# EAGLE design DC24-Darknet_Badge-shield (EAGLE 7.5.0)
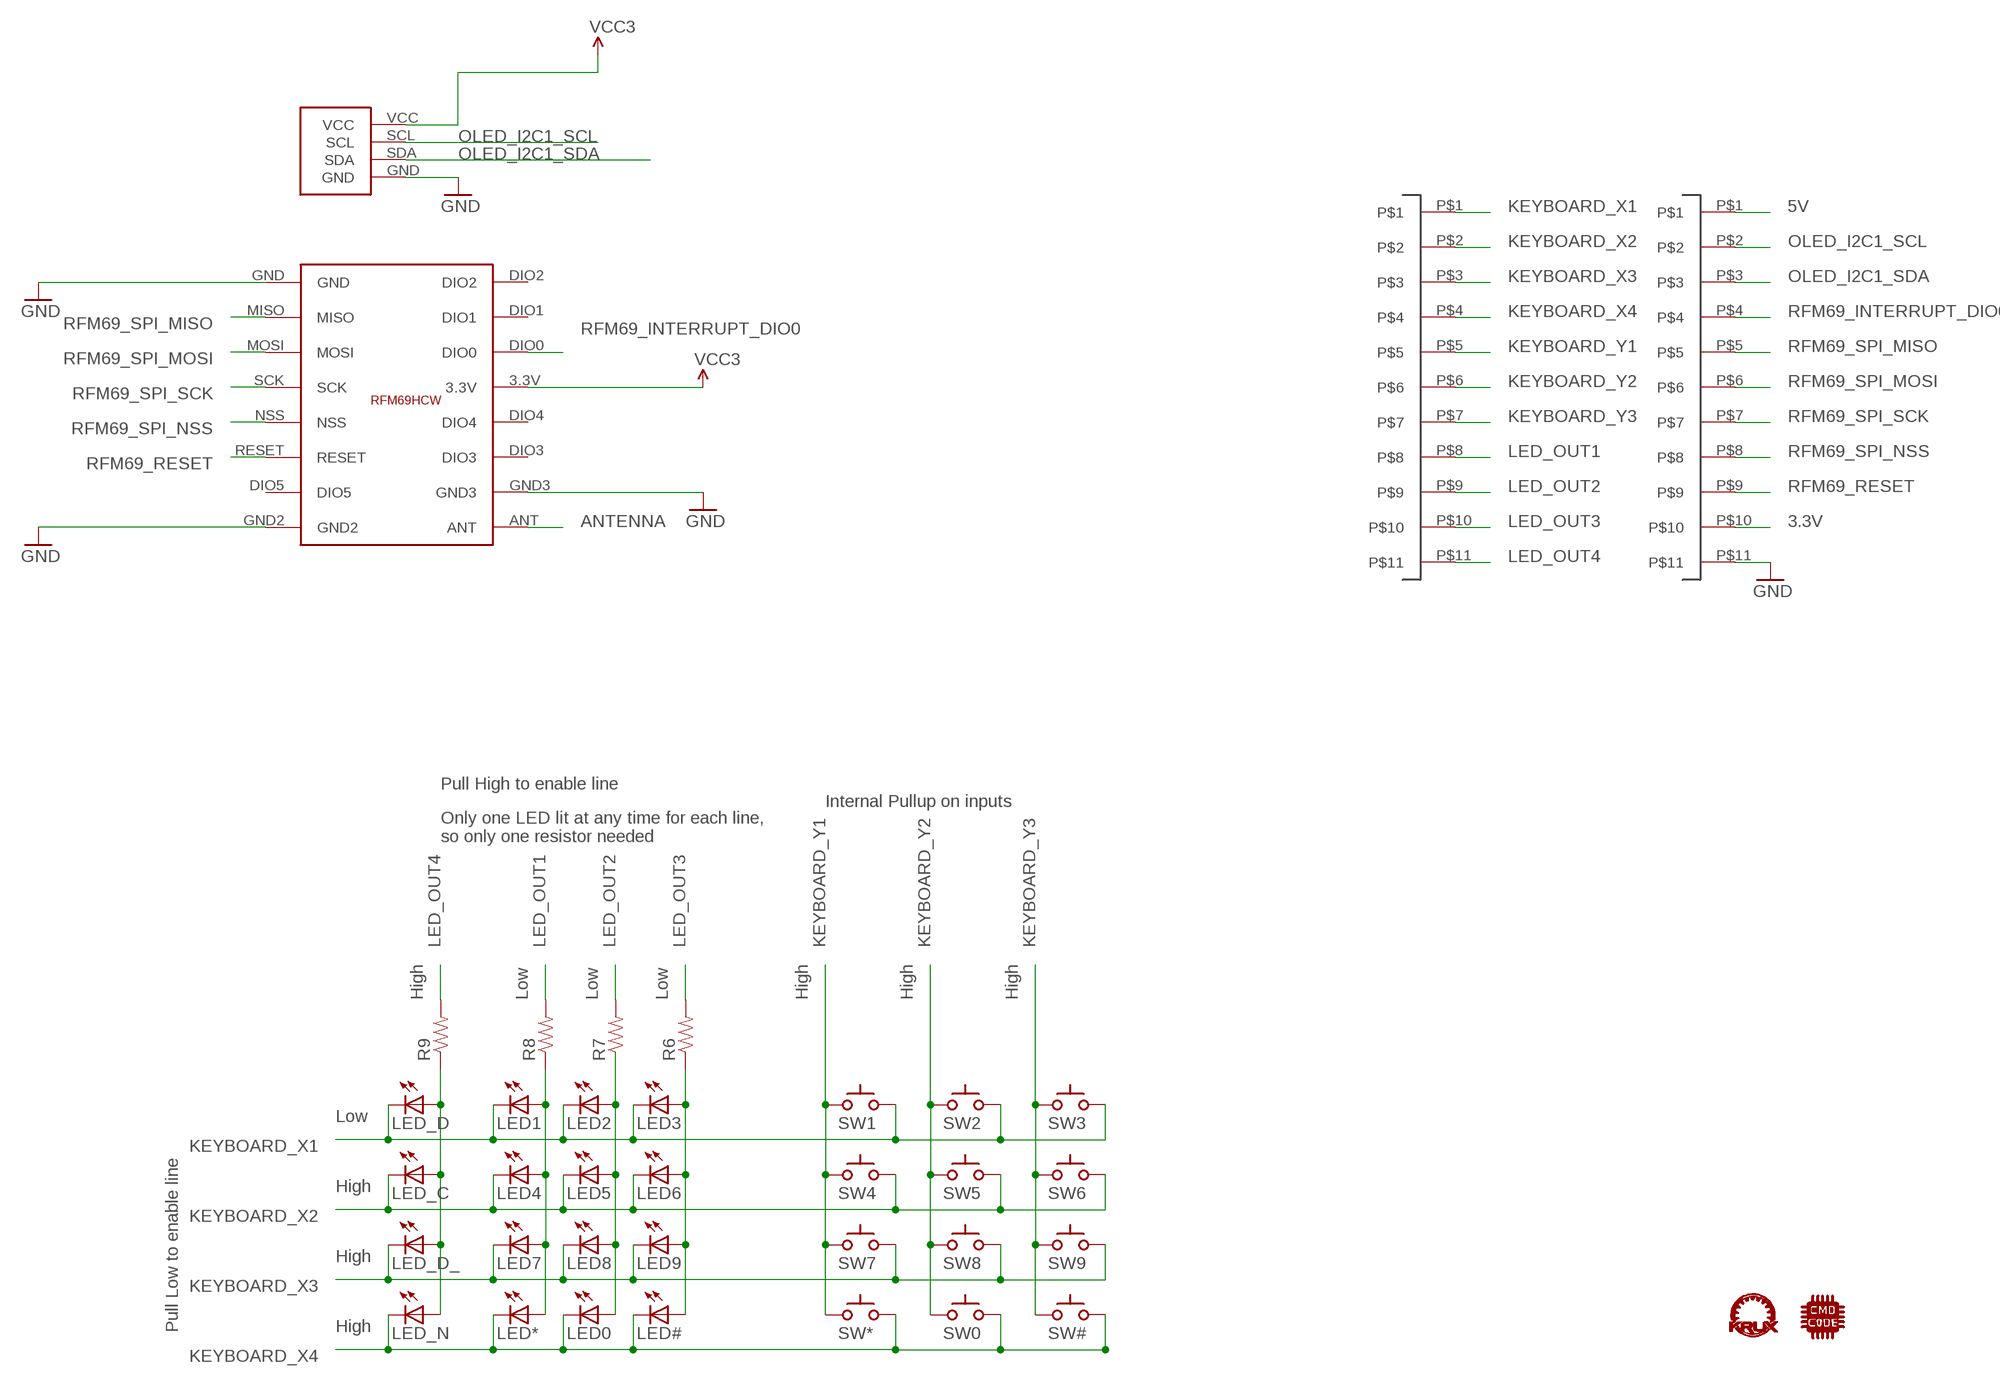
[diagram p0: schematic, sheet 1]

## Parts
LED0  LEDREVERSEMOUNT  [GULLWING_LED]
LED1  LEDREVERSEMOUNT  [GULLWING_LED]
LED2  LEDREVERSEMOUNT  [GULLWING_LED]
LED3  LEDREVERSEMOUNT  [GULLWING_LED]
LED4  LEDREVERSEMOUNT  [GULLWING_LED]
LED5  LEDREVERSEMOUNT  [GULLWING_LED]
LED6  LEDREVERSEMOUNT  [GULLWING_LED]
LED7  LEDREVERSEMOUNT  [GULLWING_LED]
LED8  LEDREVERSEMOUNT  [GULLWING_LED]
LED9  LEDREVERSEMOUNT  [GULLWING_LED]
LED#  LEDREVERSEMOUNT  [GULLWING_LED]
LED*  LEDREVERSEMOUNT  [GULLWING_LED]
LED_C  LEDREVERSEMOUNT  [GULLWING_LED]
LED_D  LEDREVERSEMOUNT  [GULLWING_LED]
LED_D_  LEDREVERSEMOUNT  [GULLWING_LED]
LED_N  LEDREVERSEMOUNT  [GULLWING_LED]
R6  RESISTOR1206  [1206]
R7  RESISTOR1206  [1206]
R8  RESISTOR1206  [1206]
R9  RESISTOR1206  [1206]
SW0  SWITCH_TACTILETACTILE-2PIN-NARROW  [TACTILE-2PIN-NARROW]
SW1  SWITCH_TACTILETACTILE-2PIN-NARROW  [TACTILE-2PIN-NARROW]
SW2  SWITCH_TACTILETACTILE-2PIN-NARROW  [TACTILE-2PIN-NARROW]
SW3  SWITCH_TACTILETACTILE-2PIN-NARROW  [TACTILE-2PIN-NARROW]
SW4  SWITCH_TACTILETACTILE-2PIN-NARROW  [TACTILE-2PIN-NARROW]
SW5  SWITCH_TACTILETACTILE-2PIN-NARROW  [TACTILE-2PIN-NARROW]
SW6  SWITCH_TACTILETACTILE-2PIN-NARROW  [TACTILE-2PIN-NARROW]
SW7  SWITCH_TACTILETACTILE-2PIN-NARROW  [TACTILE-2PIN-NARROW]
SW8  SWITCH_TACTILETACTILE-2PIN-NARROW  [TACTILE-2PIN-NARROW]
SW9  SWITCH_TACTILETACTILE-2PIN-NARROW  [TACTILE-2PIN-NARROW]
SW#  SWITCH_TACTILETACTILE-2PIN-NARROW  [TACTILE-2PIN-NARROW]
SW*  SWITCH_TACTILETACTILE-2PIN-NARROW  [TACTILE-2PIN-NARROW]
U$1  I2C_0.96_OLEDOLED  [I2C_0.96_OLED]
U$2  RFM69HCWRFN69HCWSMD  [16PIN-PCB-SMD]
U$6  HEADER_11PIN  [1X11]
U$13  HEADER_11PIN  [1X11]
U$21  KRUX_LOGO  [KRUX_LOGO]
U$23  CMD_C0DE_LOGO  [CMD_C0DE_LOGO]

## Nets
3.3V: U$1.VCC U$2.3.3V U$13.P$10 ; supply symbol labelled VCC3
5V: U$13.P$1
ANTENNA: U$2.ANT
GND: U$1.GND U$2.GND U$2.GND2 U$2.GND3 U$13.P$11
KEYBOARD_X1: LED1.C LED2.C LED3.C LED_D.C SW1.P$1(A) SW2.P$1(A) SW3.P$1(A) U$6.P$1
KEYBOARD_X2: LED4.C LED5.C LED6.C LED_C.C SW4.P$1(A) SW5.P$1(A) SW6.P$1(A) U$6.P$2
KEYBOARD_X3: LED7.C LED8.C LED9.C LED_D_.C SW7.P$1(A) SW8.P$1(A) SW9.P$1(A) U$6.P$3
KEYBOARD_X4: LED0.C LED#.C LED*.C LED_N.C SW0.P$1(A) SW#.P$1(A) SW*.P$1(A) U$6.P$4
KEYBOARD_Y1: SW1.P$2(C) SW4.P$2(C) SW7.P$2(C) SW*.P$2(C) U$6.P$5
KEYBOARD_Y2: SW0.P$2(C) SW2.P$2(C) SW5.P$2(C) SW8.P$2(C) U$6.P$6
KEYBOARD_Y3: SW3.P$2(C) SW6.P$2(C) SW9.P$2(C) SW#.P$2(C) U$6.P$7
LED_OUT1: R8.2 U$6.P$8
LED_OUT2: R7.2 U$6.P$9
LED_OUT3: R6.2 U$6.P$10
LED_OUT4: R9.2 U$6.P$11
N$8: LED3.A LED6.A LED9.A LED#.A R6.1
N$9: LED0.A LED2.A LED5.A LED8.A R7.1
N$10: LED1.A LED4.A LED7.A LED*.A R8.1
N$11: LED_C.A LED_D.A LED_D_.A LED_N.A R9.1
OLED_I2C1_SCL: U$1.SCL U$13.P$2
OLED_I2C1_SDA: U$1.SDA U$13.P$3
RFM69_INTERRUPT_DIO0: U$2.DIO0 U$13.P$4
RFM69_RESET: U$2.RESET U$13.P$9
RFM69_SPI_MISO: U$2.MISO U$13.P$5
RFM69_SPI_MOSI: U$2.MOSI U$13.P$6
RFM69_SPI_NSS: U$2.NSS U$13.P$8
RFM69_SPI_SCK: U$2.SCK U$13.P$7
Unconnected: U$2.DIO1 U$2.DIO2 U$2.DIO3 U$2.DIO4 U$2.DIO5

## Notes on the sheet
- Pull High to enable line
- Internal Pullup on inputs
- Only one LED lit at any time for each line,
  so only one resistor needed
- High | Low | Low | Low | High | High | High
- Low
- High
- High
- Pull Low to enable line | High

## Library data of the parts
LED0 LED1-LED9 LED# LED* LED_C LED_D LED_D_ LED_N = SYNShop:LED: LEDs Standard schematic elements and footprints for 5mm, 3mm, 1206, and 0603 sized LEDs. 5mm - Spark Fun Electronics SKU : COM-00529 (and others)
R6-R9 = SYNShop:RESISTOR: Resistor Basic schematic elements and footprints for 0603, 1206, and PTH resistors.
SW0 SW1-SW9 SW# SW* = SYNShop:SWITCH_TACTILE
U$1 = SYNShop:I2C_0.96_OLED
U$2 = SYNShop:RFM69HCW
U$6 U$13 = SYNShop:HEADER_11PIN
U$21 = SYNShop:KRUX_LOGO
U$23 = SYNShop:CMD_C0DE_LOGO

## Board
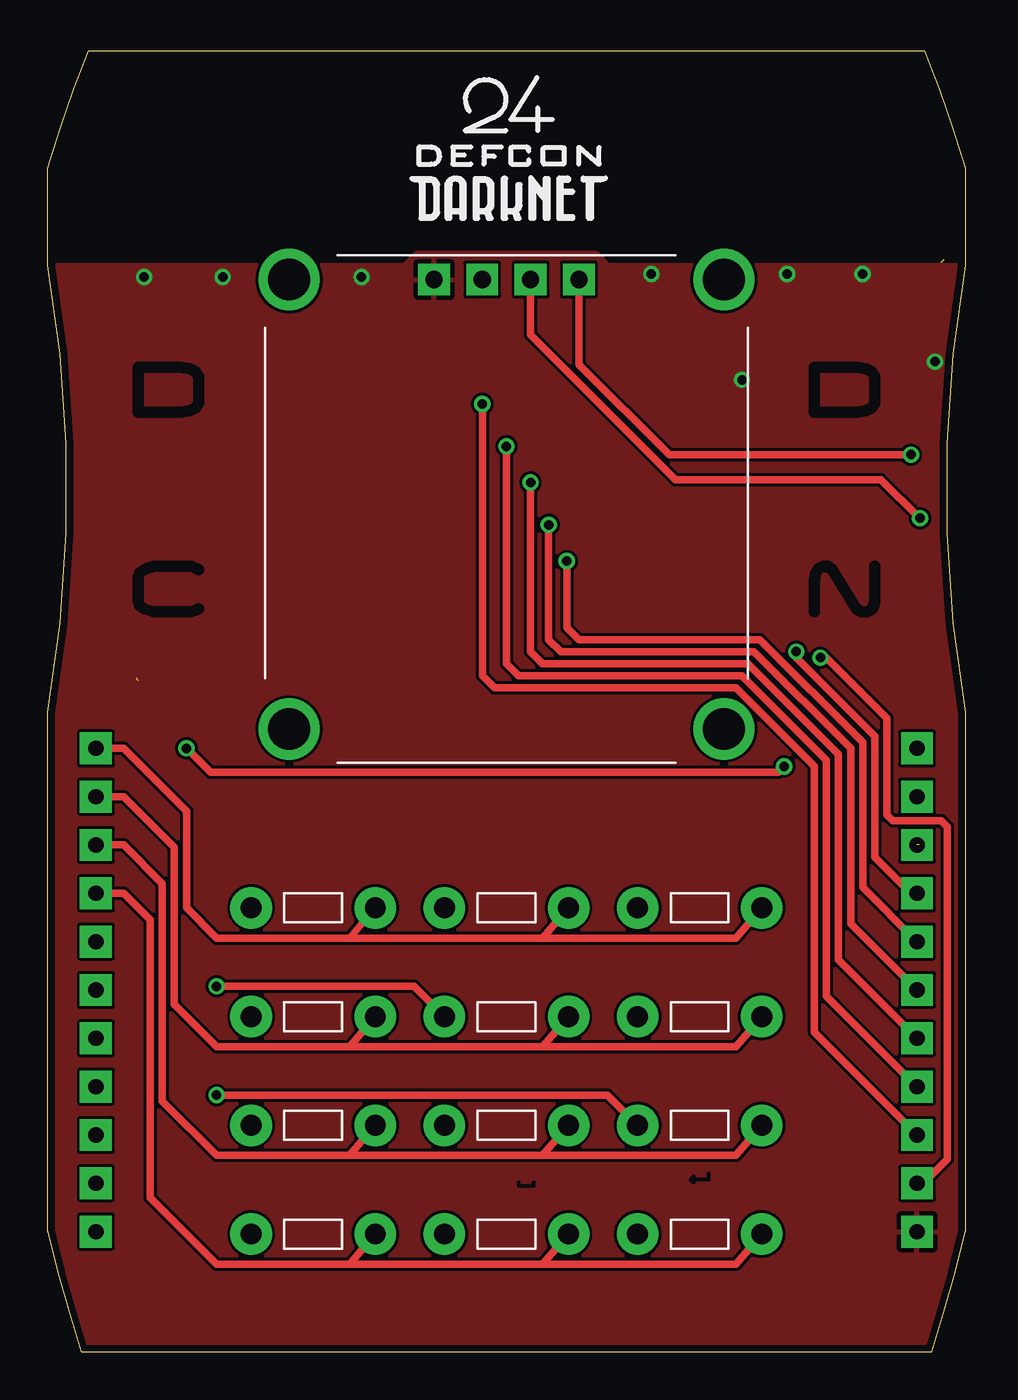
[diagram p1: board, top side]
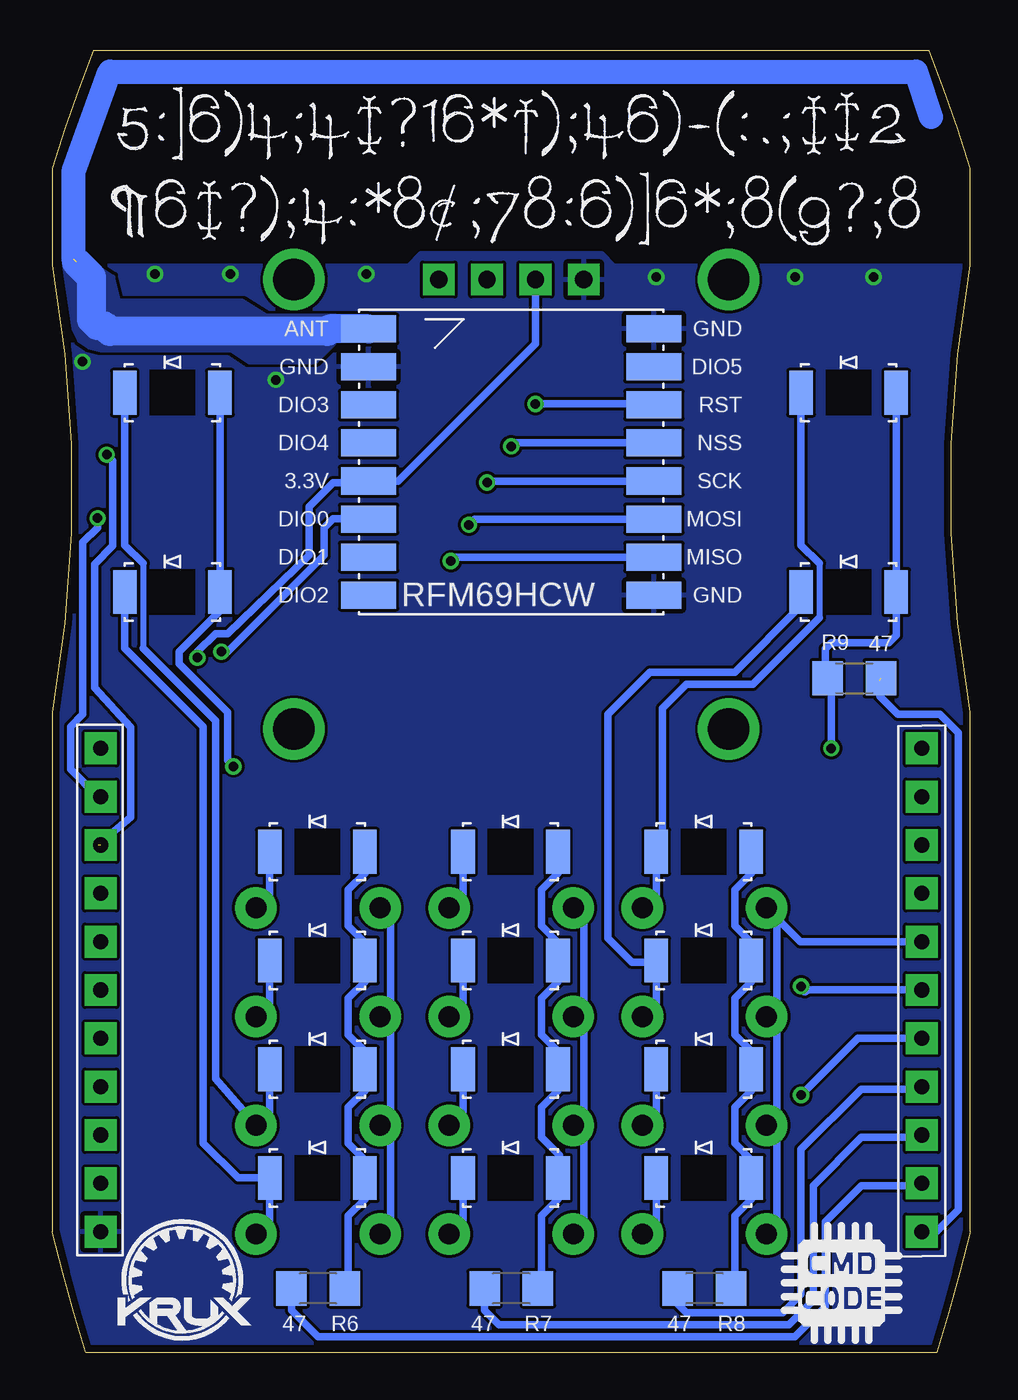
[diagram p2: board, bottom side, seen from below]

Size 48.26 x 68.42 mm. Coordinates in mm from the lower left corner, seen from the top.
Outline: 2.16,68.42 46.1,68.42 arc-5 48.26,62.23 48.26,57.15 arc20 48.26,33.66 48.26,6.35 arc-4 46.5,0.02 1.77,0 arc-4 0,6.35 0,33.66 arc20 0,57.15 0,62.23 arc-5 2.16,68.42
Copper layers (1*16): Top 0.0356mm / dielectric 1.5011mm / Bottom 0.0356mm
Design rules "LaenPCBOrder": minimum track width 6mil, minimum drill 13mil, track to track 6mil, track to pad 6mil, pad to pad 6mil, via to via 6mil, smd to smd 6mil, copper to edge 15mil, drill to drill 6mil, minimum pad ring 7mil, minimum via ring 7mil, stop-mask expansion 4mil, vias tented up to drill 0mil, thermal gap 10mil
tRestrict: 55 lines

### Footprints (pad centres in the part's own frame; a part is rotated, then mirrored left to right if it is on the bottom)
GULLWING_LED = smd 1.245 x 2.3: A 5,-1.5; C 0,-1.5
1206 = smd 1.6 x 1.8: 1 -1.4,0; 2 1.4,0
TACTILE-2PIN-NARROW = drill 1.1 pad 2.184: P$1 3.264,0; P$2 -3.264,0
I2C_0.96_OLED = drill 0.9 pad 1.676 square: GND -3.81,0; SCL 1.27,0; SDA 3.81,0; VCC -1.27,0 | drill 2.2: P$5 11.43,0; P$6 -11.43,0; P$7 11.43,-23.622; P$8 -11.43,-23.622
16PIN-PCB-SMD = smd 2.9 x 1.422: 3.3V 7.5,1; ANT 7.5,-7; DIO0 7.5,3; DIO1 7.5,5; DIO2 7.5,7; DIO3 7.5,-3; DIO4 7.5,-1; DIO5 -7.5,-5; GND -7.5,7; GND2 -7.5,-7; GND3 7.5,-5; MISO -7.5,5; MOSI -7.5,3; NSS -7.5,-1; RESET -7.5,-3; SCK -7.5,1
1X11 = drill 0.8 pad 1.676 square: P$1 0,0; P$2 0,-2.54; P$3 0,-5.08; P$4 0,-7.62; P$5 0,-10.16; P$6 0,-12.7; P$7 0,-15.24; P$8 0,-17.78; P$9 0,-20.32; P$10 0,-22.86; P$11 0,-25.4

### Placement (x,y rotation side)
LED0  26.67,10.67 0 bottom
LED1  16.51,27.81 0 bottom
LED2  26.67,27.81 0 bottom
LED3  36.83,27.81 0 bottom
LED4  16.51,22.1 0 bottom
LED5  26.67,22.1 0 bottom
LED6  36.83,22.1 0 bottom
LED7  16.51,16.38 0 bottom
LED8  26.67,16.38 0 bottom
LED9  36.83,16.38 0 bottom
LED#  36.83,10.67 0 bottom
LED*  16.51,10.67 0 bottom
LED_C  8.89,41.47 0 bottom
LED_D  8.89,51.94 0 bottom
LED_D_  44.45,51.94 0 bottom
LED_N  44.45,41.47 0 bottom
R6  34.29,3.37 180 bottom
R7  24.13,3.37 180 bottom
R8  13.97,3.37 180 bottom
R9  6.1,35.43 0 bottom
SW0  24.13,6.22 0 top
SW1  13.97,23.37 0 top
SW2  24.13,23.37 0 top
SW3  34.29,23.37 0 top
SW4  13.97,17.65 0 top
SW5  24.13,17.65 0 top
SW6  34.29,17.65 0 top
SW7  13.97,11.94 0 top
SW8  24.13,11.94 0 top
SW9  34.29,11.94 0 top
SW#  34.29,6.22 0 top
SW*  13.97,6.22 0 top
U$1  24.13,56.39 0 top
U$2  24.13,46.8 180 bottom
U$6  2.54,31.75 0 top
U$13  45.72,31.75 0 top
U$21  41.46,3.87 0 bottom
U$23  6.76,3.97 0 bottom

### Tracks (layer width: path | path; a pad name or v marks a point on that pad's centre or on a via)
3.3V  (via drill 0.5)
  Top 0.406: U$13.P$10 46.04,8.89 47.31,10.16 47.31,27.62 46.99,27.94 44.45,27.94 44.13,28.26 44.13,33.34 40.96,36.51 v40.64,36.51
  Bottom 0.406: v40.64,36.51 40.64,36.83 39.69,37.78 39.05,37.78 34.77,41.91 34.77,44.45 33.5,45.72 31.71,45.72 U$2.3.3V 30.08,45.8 22.86,53.02 U$1.VCC
ANTENNA  (1 unrouted)
  Bottom 1.27: 47.15,57.47 47.15,62.07 45.24,67.31 2.86,67.31 2.06,64.93
  Bottom 1.524: U$2.ANT 33.67,53.8 33.81,53.66 45.24,53.66 45.56,53.97 45.88,53.97 46.2,54.29 46.2,56.52 46.99,57.31
  pour Bottom: 33.34,54.45 36.99,54.45 38.26,55.25 44.77,55.25 45.09,56.52 46.04,57.15 47.62,57.15 47.15,53.82 46.83,53.18 46.35,52.86 45.72,52.7 38.89,52.7 37.94,52.07 34.45,52.07 33.34,53.18
GND  (via drill 0.5)
  other vias: 38.89,56.67 42.86,56.67 16.51,56.52 5.08,56.52 36.51,51.12 9.21,56.52 31.75,56.67 46.67,52.07
  pour Top: 0.32,33.66 0.32,6.35 1.9,0.32 46.35,0.32 47.94,6.35 47.94,33.66 46.99,41.91 46.99,49.21 47.94,57.15 37.15,57.15 36.2,58.1 34.93,58.1 33.97,57.15 29.53,57.15 28.89,57.78 19.37,57.78 18.73,57.15 14.29,57.15 13.34,58.1 12.06,58.1 11.11,57.15 0.32,57.15 1.27,48.58 1.27,42.55
  pour Bottom (rank 2): 18.73,57.15 0.32,57.15 0.95,50.17 0.95,44.45 0.63,38.73 0,33.66 0,6.35 1.9,0 46.35,0 48.26,6.35 48.26,33.66 47.31,40.32 47.31,48.58 48.26,57.15 29.53,57.15 28.89,57.78 19.37,57.78
KEYBOARD_X1
  Top 0.406: SW1.P$1 15.87,21.78 | 15.87,21.78 8.89,21.78 7.3,23.37 7.3,28.45 4,31.75 U$6.P$1 | SW2.P$1 26.04,21.78 | 26.04,21.78 15.87,21.78 | SW3.P$1 36.2,21.78 26.04,21.78
  Bottom 0.305: 7.94,41.47 7.94,38.61
  Bottom 0.406: SW1.P$1 16.51,24.09 LED1.C 16.19,26.99 16.19,33.85 14.92,35.12 11.43,35.12 7.94,38.61 | LED2.C 26.67,24.09 SW2.P$1 | LED3.C 36.83,24.09 SW3.P$1 | LED_D.C 8.89,42.42 7.94,41.47
KEYBOARD_X2
  Top 0.406: SW6.P$1 36.2,16.06 26.04,16.06 | 26.04,16.06 15.87,16.06 | 15.87,16.06 8.89,16.06 6.67,18.29 6.67,26.54 4,29.21 U$6.P$2 | SW5.P$1 26.04,16.06 | SW4.P$1 15.87,16.06
  Bottom 0.406: SW4.P$1 16.51,18.38 LED4.C 16.6,20.51 17.78,20.51 19.05,21.78 19.05,33.53 16.83,35.75 12.38,35.75 8.89,39.24 LED_C.C | LED5.C 26.67,18.38 SW5.P$1 | LED6.C 36.83,18.38 SW6.P$1
KEYBOARD_X3
  Top 0.406: SW9.P$1 36.2,10.35 26.04,10.35 | 26.04,10.35 15.87,10.35 | 15.87,10.35 8.89,10.35 6.03,13.21 6.03,24.64 4,26.67 U$6.P$3 | SW8.P$1 26.04,10.35 | SW7.P$1 15.87,10.35
  Bottom 0.305: 43.5,41.47 43.5,37.02
  Bottom 0.406: LED7.C 16.51,12.66 SW7.P$1 | LED8.C 26.67,12.66 SW8.P$1 | LED9.C 36.83,12.66 SW9.P$1 39.69,14.39 39.69,33.21 43.5,37.02 | LED_D_.C 44.45,42.42 43.5,41.47
KEYBOARD_X4
  Top 0.406: SW#.P$1 36.2,4.63 26.04,4.63 | 26.04,4.63 15.87,4.63 | 15.87,4.63 8.89,4.63 5.4,8.13 5.4,22.73 4,24.13 U$6.P$4 | SW0.P$1 26.04,4.63 | SW*.P$1 15.87,4.63
  Bottom 0.406: LED*.C 16.51,6.95 SW*.P$1 | LED0.C 26.67,6.95 SW0.P$1 | SW#.P$1 36.83,6.95 LED#.C 38.51,9.17 40.32,10.99 40.32,32.89 44.45,37.02 LED_N.C
KEYBOARD_Y1
  Bottom 0.406: SW*.P$2 10.16,6.67 10.16,11.43 SW7.P$2 10.16,12.7 10.16,17.14 SW4.P$2 10.16,18.41 10.16,22.86 SW1.P$2 8.93,21.59 U$6.P$5
KEYBOARD_Y2  (via drill 0.5)
  Top 0.406: v8.89,19.24 19.28,19.24 SW5.P$2
  Bottom 0.406: SW2.P$2 20.32,22.54 20.32,18.41 SW5.P$2 20.32,16.83 20.32,12.7 SW8.P$2 20.32,11.11 20.32,6.98 SW0.P$2 | U$6.P$6 8.7,19.05
  Bottom 0.61: 8.7,19.05 v8.89,19.24
KEYBOARD_Y3  (via drill 0.5)
  Top 0.406: v8.89,13.53 29.44,13.53 SW9.P$2
  Bottom 0.406: SW#.P$2 30.48,6.67 30.48,11.11 SW9.P$2 30.48,12.7 30.48,16.83 SW6.P$2 30.48,18.41 30.48,22.54 SW3.P$2 | U$6.P$7 5.9,16.51 v8.89,13.53
LED_OUT1
  Bottom 0.406: R8.2 15.37,2.54 14.92,2.1 9.84,2.1 8.89,3.05 8.89,10.67 5.71,13.84 2.67,13.84 U$6.P$8
LED_OUT2
  Bottom 0.406: R7.2 25.53,2.22 24.76,1.46 9.52,1.46 8.26,2.73 8.26,8.76 5.71,11.3 2.67,11.3 U$6.P$9
LED_OUT3
  Bottom 0.406: R6.2 35.69,2.22 34.29,0.83 9.21,0.83 7.62,2.41 7.62,6.86 5.71,8.76 2.67,8.76 U$6.P$10
LED_OUT4  (1 unrouted)
  Bottom 0.406: U$6.P$11 1.78,6.35 0.63,7.49 0.63,32.58 1.59,33.53 3.81,33.53 4.76,34.48 4.76,35.3
N$8
  Bottom 0.406: LED3.A 31.83,25.19 32.7,24.32 32.7,22.42 31.75,21.46 31.75,20.68 LED6.A 31.83,19.48 32.7,18.61 32.7,16.7 31.75,15.75 31.75,14.96 LED9.A 31.83,13.76 32.7,12.89 32.7,10.99 31.75,10.03 31.75,9.25 LED#.A 31.83,8.05 32.7,7.17 32.7,4 32.76,4 R6.1
N$9
  Bottom 0.406: LED2.A 21.67,25.19 22.54,24.32 22.54,22.42 21.59,21.46 21.59,20.68 LED5.A 21.67,19.48 22.54,18.61 22.54,16.7 21.59,15.75 21.59,14.96 LED8.A 21.67,13.76 22.54,12.89 22.54,11.3 21.59,10.35 21.59,9.25 LED0.A 21.67,8.05 22.54,7.17 22.54,4 22.59,4 R7.1
N$10
  Bottom 0.406: LED1.A 11.51,25.19 12.38,24.32 12.38,22.42 11.43,21.46 11.43,20.68 LED4.A 11.51,19.48 12.38,18.61 12.38,16.7 11.43,15.75 11.43,14.96 LED7.A 11.51,13.76 12.38,12.89 12.38,10.99 11.43,10.03 11.43,9.25 LED*.A 11.51,8.05 12.38,7.17 12.38,4 12.43,4 R8.1
N$11  (via drill 0.5)
  Top 0.406: v38.73,30.8 38.42,30.48 8.57,30.48 v7.3,31.75
  Bottom 0.406: LED_D_.A LED_N.A 39.45,38.97 41.59,36.83 41.59,36.2 39.05,33.66 39.05,31.12 v38.73,30.8 | 4.13,50.68 LED_D.A LED_C.A 3.89,37.7 4.29,37.31 7.3,37.31 7.62,36.99 7.62,35.56 R9.1 7.3,35.24 v7.3,31.75
N$12
  pour Top: 31.12,27.18 31.12,25.27 37.46,25.27 37.46,27.18
  pour Top: 31.12,21.46 31.12,19.56 37.46,19.56 37.46,21.46
  pour Top: 20.95,27.18 20.95,25.27 27.3,25.27 27.3,27.18
  pour Top: 31.12,15.75 31.12,13.84 37.46,13.84 37.46,15.75
  pour Top: 31.12,10.03 31.12,8.13 37.46,8.13 37.46,10.03
  pour Top: 20.95,10.03 20.95,8.13 27.3,8.13 27.3,10.03
  pour Top: 20.95,15.75 20.95,13.84 27.3,13.84 27.3,15.75
  pour Top: 20.95,21.46 20.95,19.56 27.3,19.56 27.3,21.46
  pour Top: 20.95,27.18 20.95,25.27 27.3,25.27 27.3,27.18
  pour Top: 10.79,27.18 10.79,25.27 17.15,25.27 17.15,27.18
  pour Top: 10.79,21.46 10.79,19.56 17.15,19.56 17.15,21.46
  pour Top: 10.79,15.75 10.79,13.84 17.15,13.84 17.15,15.75
  pour Top: 10.79,10.03 10.79,8.13 17.15,8.13 17.15,10.03
OLED_I2C1_SCL  (via drill 0.5)
  Top 0.406: v45.88,43.85 43.81,45.88 33.02,45.88 25.4,53.5 U$1.SCL
  Bottom 0.406: v45.88,43.85 45.88,43.34 46.67,42.58 46.67,33.53 47.31,32.89 47.31,30.64 45.88,29.21 U$13.P$2
OLED_I2C1_SDA  (via drill 0.5)  (1 unrouted)
  Top 0.406: v45.4,47.18 32.7,47.18 27.94,51.91 U$1.SDA
  Bottom 0.406: 45.85,26.67 44.13,28.13 44.13,32.86 46.04,34.93 46.04,41.43 45.09,42.39 45.09,46.86 v45.4,47.18 | 27.94,56.2 U$1.SDA
RFM69_INTERRUPT_DIO0  (via drill 0.5)
  Top 0.406: U$13.P$4 45.4,24.13 43.5,26.04 43.5,32.38 39.37,36.51 v39.37,36.83
  Bottom 0.406: v39.37,36.83 39.05,36.83 33.97,41.91 33.97,43.34 33.5,43.81 31.65,43.81 U$2.DIO0
RFM69_RESET  (via drill 0.5)
  Top 0.406: U$13.P$9 40.32,16.83 40.32,30.8 36.2,34.93 23.49,34.93 22.86,35.56 v22.86,49.85
  Bottom 0.406: v22.86,49.85 16.68,49.85 U$2.RESET
RFM69_SPI_MISO  (via drill 0.5)
  Top 0.406: U$13.P$5 42.86,24.45 42.86,32.07 37.46,37.47 27.94,37.47 27.3,38.1 v27.3,41.59
  Bottom 0.406: U$2.MISO 27.1,41.8 v27.3,41.59
RFM69_SPI_MOSI  (via drill 0.5)
  Top 0.406: U$13.P$6 42.23,22.54 42.23,31.75 37.15,36.83 26.99,36.83 26.35,37.47 v26.35,43.5
  Bottom 0.406: U$2.MOSI 26.05,43.8 v26.35,43.5
RFM69_SPI_NSS  (via drill 0.5)
  Top 0.406: U$13.P$8 40.96,18.73 40.96,31.12 36.51,35.56 24.76,35.56 24.13,36.2 v24.13,47.62
  Bottom 0.406: U$2.NSS 23.95,47.8 v24.13,47.62
RFM69_SPI_SCK  (via drill 0.5)
  Top 0.406: U$13.P$7 41.59,20.64 41.59,31.43 36.83,36.2 26.04,36.2 25.4,36.83 v25.4,45.72
  Bottom 0.406: U$2.SCK 25,45.8 v25.4,45.72

### Text on the board
tStop: 1 | ., | ? | 2 ABC | 3 DEF | 4 GHI | 5 JKL | 6 MNO | 7PQRS | 8 TUV | 9WXYZ | *#+ | 0
tRestrict: 1 | ., | ? | 2 ABC | 3 DEF | 4 GHI | 5 JKL | 6 MNO | 7PQRS | 8 TUV | 9WXYZ | *#+ | 0
_bsilk: 47 | 47 | 47 | 47